# Altium project MCH_CLKB.PrjPcb (part 1 of 2)
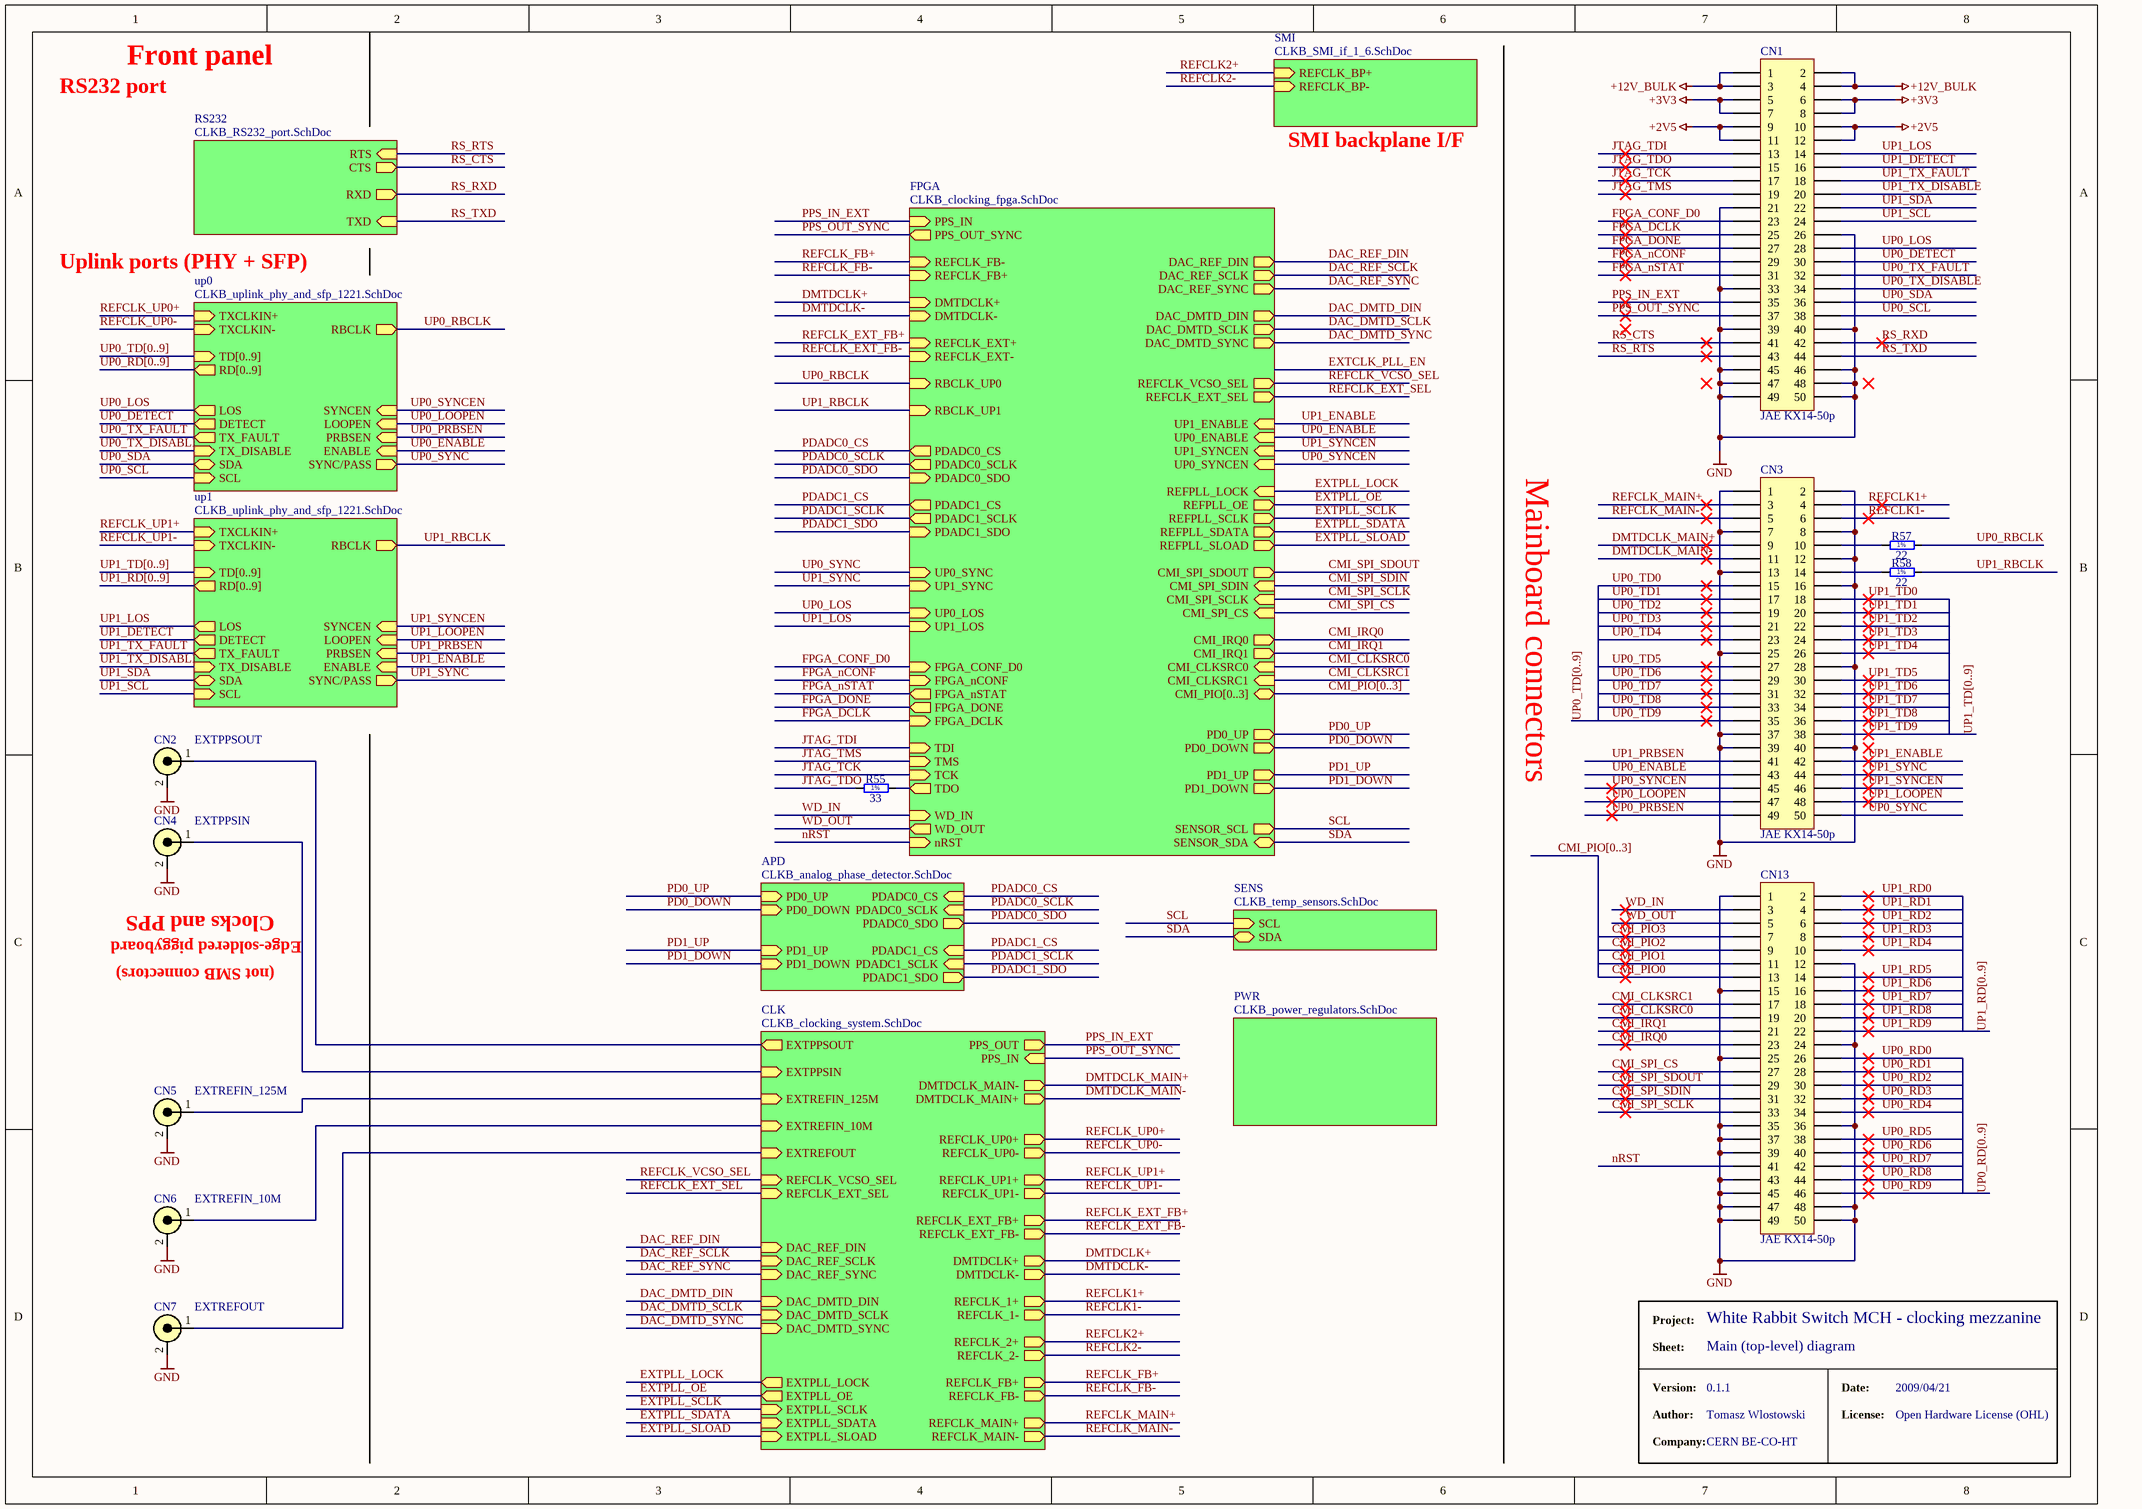
[diagram p0: CLKB_main.SchDoc]
7 sheets, 236 parts. Net scope: hierarchical (ports join the sheet entries above them; power ports are global).
Board file: MCH_CLKB_PCB.PcbDoc
Sheets:
  CLKB_main.SchDoc
    APD = CLKB_analog_phase_detector.SchDoc
    CLK = CLKB_clocking_system.SchDoc
    PWR = CLKB_power_regulators.SchDoc
    FPGA = CLKB_clocking_fpga.SchDoc
    RS232 = CLKB_RS232_port.SchDoc
    SENS = CLKB_temp_sensors.SchDoc

## Sheet CLKB_main.SchDoc
size A3

### Parts
CN1  JAE KX14-50p  [JAE_KX14_50P]
CN2  EXTPPSOUT  [MCH_SPECIAL_FP_CLOCKS]
CN3  JAE KX14-50p  [JAE_KX14_50P]
CN4  EXTPPSIN  [MCH_SPECIAL_FP_CLOCKS]
CN5  EXTREFIN_125M  [MCH_SPECIAL_FP_CLOCKS]
CN6  EXTREFIN_10M  [MCH_SPECIAL_FP_CLOCKS]
CN7  EXTREFOUT  [MCH_SPECIAL_FP_CLOCKS]
CN13  JAE KX14-50p  [JAE_KX14_50P]
R55  33  [RESC1608X55N]
R57  22  [RESC1608X55N]
R58  22  [RESC1608X55N]

### Sub-sheets
APD = CLKB_analog_phase_detector.SchDoc: PDADC1_SDO (out), PD0_UP (in), PDADC1_CS (in), PD1_DOWN (in), PD0_DOWN (in), PDADC0_CS (in), PDADC0_SDO (out), PDADC1_SCLK (in), PDADC0_SCLK (in), PD1_UP (in)
CLK = CLKB_clocking_system.SchDoc: EXTREFIN_10M (in), EXTREFIN_125M (in), REFCLK_EXT_SEL (in), EXTREFOUT (in), REFCLK_MAIN+ (out), REFCLK_MAIN- (out), REFCLK_FB+ (out), REFCLK_FB- (out), REFCLK_UP0+ (out), REFCLK_1- (out), REFCLK_2+ (out), REFCLK_2- (out), REFCLK_UP1- (out), REFCLK_1+ (out), DMTDCLK+ (out), DMTDCLK- (out), REFCLK_EXT_FB+ (out), REFCLK_EXT_FB- (out), DAC_DMTD_SYNC (in), DAC_DMTD_SCLK (in), DAC_DMTD_DIN (in), DAC_REF_SYNC (in), DAC_REF_SCLK (in), REFCLK_UP1+ (out), DAC_REF_DIN (in), REFCLK_UP0- (out), DMTDCLK_MAIN+ (out), DMTDCLK_MAIN- (out), REFCLK_VCSO_SEL (in), EXTPPSIN (in), PPS_IN (in), PPS_OUT (out), EXTPPSOUT (out), EXTPLL_LOCK (out), EXTPLL_OE (out), EXTPLL_SLOAD (in), EXTPLL_SDATA (in), EXTPLL_SCLK (in)
FPGA = CLKB_clocking_fpga.SchDoc: TDI (in), TDO (out), TCK (in), TMS (in), REFCLK_FB- (in), DMTDCLK+ (in), DMTDCLK- (in), REFCLK_EXT+ (in), REFCLK_EXT- (in), RBCLK_UP0 (in), RBCLK_UP1 (in), CMI_SPI_SDIN (in), CMI_SPI_SCLK (in), UP0_LOS (in), CMI_SPI_CS (in), CMI_SPI_SDOUT (out), UP1_LOS (in), FPGA_DCLK (in), DAC_REF_SYNC (out), DAC_REF_DIN (out), DAC_REF_SCLK (out), DAC_DMTD_SYNC (out), DAC_DMTD_SCLK (out), DAC_DMTD_DIN (out), CMI_IRQ0 (out), CMI_IRQ1 (out), CMI_CLKSRC0 (in), CMI_CLKSRC1 (in), CMI_PIO[0..3] (bidir), REFCLK_VCSO_SEL (out), REFCLK_EXT_SEL (out), UP0_SYNC (in), PDADC0_CS (out), PDADC0_SDO (in), PDADC0_SCLK (out), UP1_SYNC (in), FPGA_CONF_D0 (in), PDADC1_CS (out), PDADC1_SDO (in), PDADC1_SCLK (out), PD0_UP (out), PD0_DOWN (out), PD1_UP (out), PD1_DOWN (out), FPGA_DONE (out), FPGA_nCONF (in), FPGA_nSTAT (out), REFCLK_FB+ (in), UP1_ENABLE (in), UP0_ENABLE (in), UP1_SYNCEN (in), UP0_SYNCEN (in), WD_IN (in), WD_OUT (out), nRST (in), SENSOR_SCL (out), SENSOR_SDA (bidir), REFPLL_OE (out), REFPLL_SCLK (out), REFPLL_SDATA (out), REFPLL_SLOAD (out), REFPLL_LOCK (in), PPS_IN (in), PPS_OUT_SYNC (out)
PWR = CLKB_power_regulators.SchDoc: no entries
RS232 = CLKB_RS232_port.SchDoc: TXD (in), RXD (out), CTS (out), RTS (in)
SENS = CLKB_temp_sensors.SchDoc: SDA (bidir), SCL (in)
SMI = CLKB_SMI_if_1_6.SchDoc (file not in this document): REFCLK_BP+ (in), REFCLK_BP- (in)
up0 = CLKB_uplink_phy_and_sfp_1221.SchDoc (file not in this document): TD[0..9] (in), TXCLKIN+ (in), TXCLKIN- (in), TX_FAULT (out), TX_DISABLE (in), SDA (bidir), SCL (in), DETECT (out), LOS (out), SYNCEN (in), LOOPEN (in), PRBSEN (in), ENABLE (in), RBCLK (out), SYNC/PASS (out), RD[0..9] (out)
up1 = CLKB_uplink_phy_and_sfp_1221.SchDoc (file not in this document): TD[0..9] (in), TXCLKIN+ (in), TXCLKIN- (in), TX_FAULT (out), TX_DISABLE (in), SDA (bidir), SCL (in), DETECT (out), LOS (out), SYNCEN (in), LOOPEN (in), PRBSEN (in), ENABLE (in), RBCLK (out), SYNC/PASS (out), RD[0..9] (out)

### Nets
+2V5: CN1.9 CN1.10 CN1.11 CN1.12
+3V3: CN1.5 CN1.6 CN1.7 CN1.8
+12V_BULK: CN1.1 CN1.2 CN1.3 CN1.4
GND: CN1.21 CN1.26 CN1.33 CN1.39 CN1.40 CN1.45 CN1.46 CN1.47 CN1.48 CN1.49 CN1.50 CN2.2(GND) CN3.1 CN3.2 CN3.7 CN3.8 CN3.12 CN3.13 CN3.16 CN3.25 CN3.28 CN3.37 CN3.39 CN3.40 CN4.2(GND) CN5.2(GND) CN6.2(GND) CN7.2(GND) CN13.1 CN13.12 CN13.15 CN13.24 CN13.25 CN13.35 CN13.36 CN13.37 CN13.39 CN13.43 CN13.45 CN13.47 CN13.48 CN13.49 CN13.50
CMI_CLKSRC0: CN13.19 ; sheet FPGA/CMI_CLKSRC0
CMI_CLKSRC1: CN13.17 ; sheet FPGA/CMI_CLKSRC1
CMI_IRQ0: CN13.23 ; sheet FPGA/CMI_IRQ0
CMI_IRQ1: CN13.21 ; sheet FPGA/CMI_IRQ1
CMI_PIO0: CN13.13
CMI_PIO1: CN13.11
CMI_PIO2: CN13.9
CMI_PIO3: CN13.7
CMI_SPI_CS: CN13.27 ; sheet FPGA/CMI_SPI_CS
CMI_SPI_SCLK: CN13.33 ; sheet FPGA/CMI_SPI_SCLK
CMI_SPI_SDIN: CN13.31 ; sheet FPGA/CMI_SPI_SDIN
CMI_SPI_SDOUT: CN13.29 ; sheet FPGA/CMI_SPI_SDOUT
DAC_DMTD_DIN: sheet CLK/DAC_DMTD_DIN, sheet FPGA/DAC_DMTD_DIN
DAC_DMTD_SCLK: sheet CLK/DAC_DMTD_SCLK, sheet FPGA/DAC_DMTD_SCLK
DAC_DMTD_SYNC: sheet CLK/DAC_DMTD_SYNC, sheet FPGA/DAC_DMTD_SYNC
DAC_REF_DIN: sheet CLK/DAC_REF_DIN, sheet FPGA/DAC_REF_DIN
DAC_REF_SCLK: sheet CLK/DAC_REF_SCLK, sheet FPGA/DAC_REF_SCLK
DAC_REF_SYNC: sheet CLK/DAC_REF_SYNC, sheet FPGA/DAC_REF_SYNC
DMTDCLK+: sheet CLK/DMTDCLK+, sheet FPGA/DMTDCLK+
DMTDCLK-: sheet CLK/DMTDCLK-, sheet FPGA/DMTDCLK-
DMTDCLK_MAIN+: CN3.9 ; sheet CLK/DMTDCLK_MAIN-
DMTDCLK_MAIN-: CN3.11 ; sheet CLK/DMTDCLK_MAIN+
EXTPLL_LOCK: sheet CLK/EXTPLL_LOCK, sheet FPGA/REFPLL_LOCK
EXTPLL_OE: sheet CLK/EXTPLL_OE, sheet FPGA/REFPLL_OE
EXTPLL_SCLK: sheet CLK/EXTPLL_SCLK, sheet FPGA/REFPLL_SCLK
EXTPLL_SDATA: sheet CLK/EXTPLL_SDATA, sheet FPGA/REFPLL_SDATA
EXTPLL_SLOAD: sheet CLK/EXTPLL_SLOAD, sheet FPGA/REFPLL_SLOAD
EXTPPSIN: CN4.1(HOT) ; sheet CLK/EXTPPSIN
EXTPPSOUT: CN2.1(HOT) ; sheet CLK/EXTPPSOUT
EXTREFIN_10M: CN6.1(HOT) ; sheet CLK/EXTREFIN_10M
EXTREFIN_125M: CN5.1(HOT) ; sheet CLK/EXTREFIN_125M
EXTREFOUT: CN7.1(HOT) ; sheet CLK/EXTREFOUT
FPGA_CONF_D0: CN1.23 ; sheet FPGA/FPGA_CONF_D0
FPGA_DCLK: CN1.25 ; sheet FPGA/FPGA_DCLK
FPGA_DONE: CN1.27 ; sheet FPGA/FPGA_DONE
FPGA_nCONF: CN1.29 ; sheet FPGA/FPGA_nCONF
FPGA_nSTAT: CN1.31 ; sheet FPGA/FPGA_nSTAT
JTAG_TCK: CN1.17 ; sheet FPGA/TCK
JTAG_TDI: CN1.13 ; sheet FPGA/TDI
JTAG_TDO: CN1.15 R55.1
JTAG_TMS: CN1.19 ; sheet FPGA/TMS
nRST: CN13.41 ; sheet FPGA/nRST
PD0_DOWN: sheet APD/PD0_DOWN, sheet FPGA/PD0_DOWN
PD0_UP: sheet APD/PD0_UP, sheet FPGA/PD0_UP
PD1_DOWN: sheet APD/PD1_DOWN, sheet FPGA/PD1_DOWN
PD1_UP: sheet APD/PD1_UP, sheet FPGA/PD1_UP
PDADC0_CS: sheet APD/PDADC0_CS, sheet FPGA/PDADC0_CS
PDADC0_SCLK: sheet APD/PDADC0_SCLK, sheet FPGA/PDADC0_SCLK
PDADC0_SDO: sheet APD/PDADC0_SDO, sheet FPGA/PDADC0_SDO
PDADC1_CS: sheet APD/PDADC1_CS, sheet FPGA/PDADC1_CS
PDADC1_SCLK: sheet APD/PDADC1_SCLK, sheet FPGA/PDADC1_SCLK
PDADC1_SDO: sheet APD/PDADC1_SDO, sheet FPGA/PDADC1_SDO
PPS_IN_EXT: CN1.35 ; sheet CLK/PPS_OUT, sheet FPGA/PPS_IN
PPS_OUT_SYNC: CN1.37 ; sheet CLK/PPS_IN, sheet FPGA/PPS_OUT_SYNC
REFCLK1+: CN3.4 ; sheet CLK/REFCLK_1+
REFCLK1-: CN3.6 ; sheet CLK/REFCLK_1-
REFCLK2+: sheet CLK/REFCLK_2+, sheet SMI/REFCLK_BP+
REFCLK2-: sheet CLK/REFCLK_2-, sheet SMI/REFCLK_BP-
REFCLK_EXT_FB+: sheet CLK/REFCLK_EXT_FB+, sheet FPGA/REFCLK_EXT+
REFCLK_EXT_FB-: sheet CLK/REFCLK_EXT_FB-, sheet FPGA/REFCLK_EXT-
REFCLK_EXT_SEL: sheet CLK/REFCLK_EXT_SEL, sheet FPGA/REFCLK_EXT_SEL
REFCLK_FB+: sheet CLK/REFCLK_FB+, sheet FPGA/REFCLK_FB-
REFCLK_FB-: sheet CLK/REFCLK_FB-, sheet FPGA/REFCLK_FB+
REFCLK_MAIN+: CN3.3 ; sheet CLK/REFCLK_MAIN+
REFCLK_MAIN-: CN3.5 ; sheet CLK/REFCLK_MAIN-
REFCLK_UP0+: sheet CLK/REFCLK_UP0+, sheet up0/TXCLKIN+
REFCLK_UP0-: sheet CLK/REFCLK_UP0-, sheet up0/TXCLKIN-
REFCLK_UP1+: sheet CLK/REFCLK_UP1+, sheet up1/TXCLKIN+
REFCLK_UP1-: sheet CLK/REFCLK_UP1-, sheet up1/TXCLKIN-
REFCLK_VCSO_SEL: sheet CLK/REFCLK_VCSO_SEL, sheet FPGA/REFCLK_VCSO_SEL
RS_CTS: CN1.41 ; sheet RS232/CTS
RS_RTS: CN1.43 ; sheet RS232/RTS
RS_RXD: CN1.42 ; sheet RS232/RXD
RS_TXD: CN1.44 ; sheet RS232/TXD
SCL: sheet FPGA/SENSOR_SCL, sheet SENS/SCL
SDA: sheet FPGA/SENSOR_SDA, sheet SENS/SDA
TDO: R55.2 ; sheet FPGA/TDO
UP0_DETECT: CN1.30 ; sheet up0/DETECT
UP0_ENABLE: CN3.43 ; sheet FPGA/UP0_ENABLE, sheet up0/ENABLE
UP0_LOOPEN: CN3.47 ; sheet up0/LOOPEN
UP0_LOS: CN1.28 ; sheet FPGA/UP0_LOS, sheet up0/LOS
UP0_PRBSEN: CN3.49 ; sheet up0/PRBSEN
UP0_RBCLK: R57.2 ; sheet FPGA/RBCLK_UP0, sheet up0/RBCLK
UP0_RD0: CN13.26
UP0_RD1: CN13.28
UP0_RD2: CN13.30
UP0_RD3: CN13.32
UP0_RD4: CN13.34
UP0_RD5: CN13.38
UP0_RD6: CN13.40
UP0_RD7: CN13.42
UP0_RD8: CN13.44
UP0_RD9: CN13.46
UP0_SCL: CN1.38 ; sheet up0/SCL
UP0_SDA: CN1.36 ; sheet up0/SDA
UP0_SYNC: CN3.50 ; sheet FPGA/UP0_SYNC, sheet up0/SYNC/PASS
UP0_SYNCEN: CN3.45 ; sheet FPGA/UP0_SYNCEN, sheet up0/SYNCEN
UP0_TD0: CN3.15
UP0_TD1: CN3.17
UP0_TD2: CN3.19
UP0_TD3: CN3.21
UP0_TD4: CN3.23
UP0_TD5: CN3.27
UP0_TD6: CN3.29
UP0_TD7: CN3.31
UP0_TD8: CN3.33
UP0_TD9: CN3.35
UP0_TX_DISABLE: CN1.34 ; sheet up0/TX_DISABLE
UP0_TX_FAULT: CN1.32 ; sheet up0/TX_FAULT
UP1_DETECT: CN1.16 ; sheet up1/DETECT
UP1_ENABLE: CN3.42 ; sheet FPGA/UP1_ENABLE, sheet up1/ENABLE
UP1_LOOPEN: CN3.48 ; sheet up1/LOOPEN
UP1_LOS: CN1.14 ; sheet FPGA/UP1_LOS, sheet up1/LOS
UP1_PRBSEN: CN3.41 ; sheet up1/PRBSEN
UP1_RBCLK: R58.2 ; sheet FPGA/RBCLK_UP1, sheet up1/RBCLK
UP1_RD0: CN13.2
UP1_RD1: CN13.4
UP1_RD2: CN13.6
UP1_RD3: CN13.8
UP1_RD4: CN13.10
UP1_RD5: CN13.14
UP1_RD6: CN13.16
UP1_RD7: CN13.18
UP1_RD8: CN13.20
UP1_RD9: CN13.22
UP1_SCL: CN1.24 ; sheet up1/SCL
UP1_SDA: CN1.22 ; sheet up1/SDA
UP1_SYNC: CN3.44 ; sheet FPGA/UP1_SYNC, sheet up1/SYNC/PASS
UP1_SYNCEN: CN3.46 ; sheet FPGA/UP1_SYNCEN, sheet up1/SYNCEN
UP1_TD0: CN3.18
UP1_TD1: CN3.20
UP1_TD2: CN3.22
UP1_TD3: CN3.24
UP1_TD4: CN3.26
UP1_TD5: CN3.30
UP1_TD6: CN3.32
UP1_TD7: CN3.34
UP1_TD8: CN3.36
UP1_TD9: CN3.38
UP1_TX_DISABLE: CN1.20 ; sheet up1/TX_DISABLE
UP1_TX_FAULT: CN1.18 ; sheet up1/TX_FAULT
WD_IN: CN13.3 ; sheet FPGA/WD_IN
WD_OUT: CN13.5 ; sheet FPGA/WD_OUT
NetCN3_10: CN3.10 R57.1
NetCN3_14: CN3.14 R58.1

### Buses and harness runs
bus CMI_PIO[0..3]
bus CMI_PIO[0..3] = sheet FPGA/CMI_PIO[0..3]
bus UP0_RD[0..9]
bus UP0_RD[0..9] = sheet up0/RD[0..9]
bus UP0_TD[0..9]
bus UP0_TD[0..9] = sheet up0/TD[0..9]
bus UP1_RD[0..9]
bus UP1_RD[0..9] = sheet up1/RD[0..9]
bus UP1_TD[0..9]
bus UP1_TD[0..9] = sheet up1/TD[0..9]

### Notes on the sheet
- RS232 port
- Front panel
- SMI backplane I/F
- Uplink ports (PHY + SFP)
- Mainboard connectors
- Clocks and PPS
- (not SMB connectors)
- Edge-soldered piggyboard
- Project:
- White Rabbit Switch MCH - clocking mezzanine
- Sheet:
- Version:
- Main (top-level) diagram
- 0.1.1
- Date:
- 2009/04/21
- Author:
- Company:
- Tomasz Wlostowski
- CERN BE-CO-HT
- License:
- Open Hardware License (OHL)
- (in symbol R0603_22R_1%_0.1W_100PPM) 1%
- (in symbol R0603_33R_1%_0.1W_100PPM) 1%

### Library data of the parts
CN1 CN3 CN13 = KX14_50p: multipin B2B connector (plug); Supplier: Farnell
CN2 CN4-CN7 = SMA_SOCKET: SMB piggyboard connection
R55 = R0603_33R_1%_0.1W_100PPM: Resistor - 1%; Part Description: General Purpose Thick Film Chip Resistor; Manufacturer: GENERIC; Manufacturer1 Part Number: NRC06F33R0TRF; Manufacturer1 Datasheet: \\cern.ch\dfs\Applications\Altium\Datasheets\R0603_NIC_NRC.pdf; Power: 0.1W; TC: ±100ppm/°C; Table: Resistors SMD; Part Number: R0603_33R_1%_0.1W_100PPM; Component Kind: Standard; Component Type: Standard; Designator: Resistor - 1%; Library Reference: Resistor - 1%; Pin Count: 2; Value: 33; Status: Preferred; Tolerance: ±1%; Manufacturer Part Number: R0603_33R_1%_0.1W_100PPM; Case: 0603; Mounted: Yes; Socket: No; SMD: Yes; Manufacturer1 Example: NIC COMPONENT; Manufacturer1 ComponentHeight: 0.55mm; HelpURL: \\cern.ch\dfs\Applications\Altium\Datasheets\R0603_NIC_NRC.pdf; Author: CERN DEM JLC; CreateDate: 12/3/2007; LatestRevisionDate: 3/13/2008
R57 R58 = R0603_22R_1%_0.1W_100PPM: Resistor - 1%; Part Description: General Purpose Thick Film Chip Resistor; Manufacturer: GENERIC; Manufacturer1 Part Number: NRC06F22R0TRF; Manufacturer1 Datasheet: \\cern.ch\dfs\Applications\Altium\Datasheets\R0603_NIC_NRC.pdf; Power: 0.1W; TC: ±100ppm/°C; Table: Resistors SMD; Part Number: R0603_22R_1%_0.1W_100PPM; Component Kind: Standard; Component Type: Standard; Designator: Resistor - 1%; Library Reference: Resistor - 1%; Pin Count: 2; Value: 22; Status: Preferred; Tolerance: ±1%; Manufacturer Part Number: R0603_22R_1%_0.1W_100PPM; Case: 0603; Mounted: Yes; Socket: No; SMD: Yes; Manufacturer1 Example: NIC COMPONENT; Manufacturer1 ComponentHeight: 0.55mm; HelpURL: \\cern.ch\dfs\Applications\Altium\Datasheets\R0603_NIC_NRC.pdf; Author: CERN DEM JLC; CreateDate: 12/3/2007; LatestRevisionDate: 3/13/2008

## Sheet CLKB_analog_phase_detector.SchDoc
size A
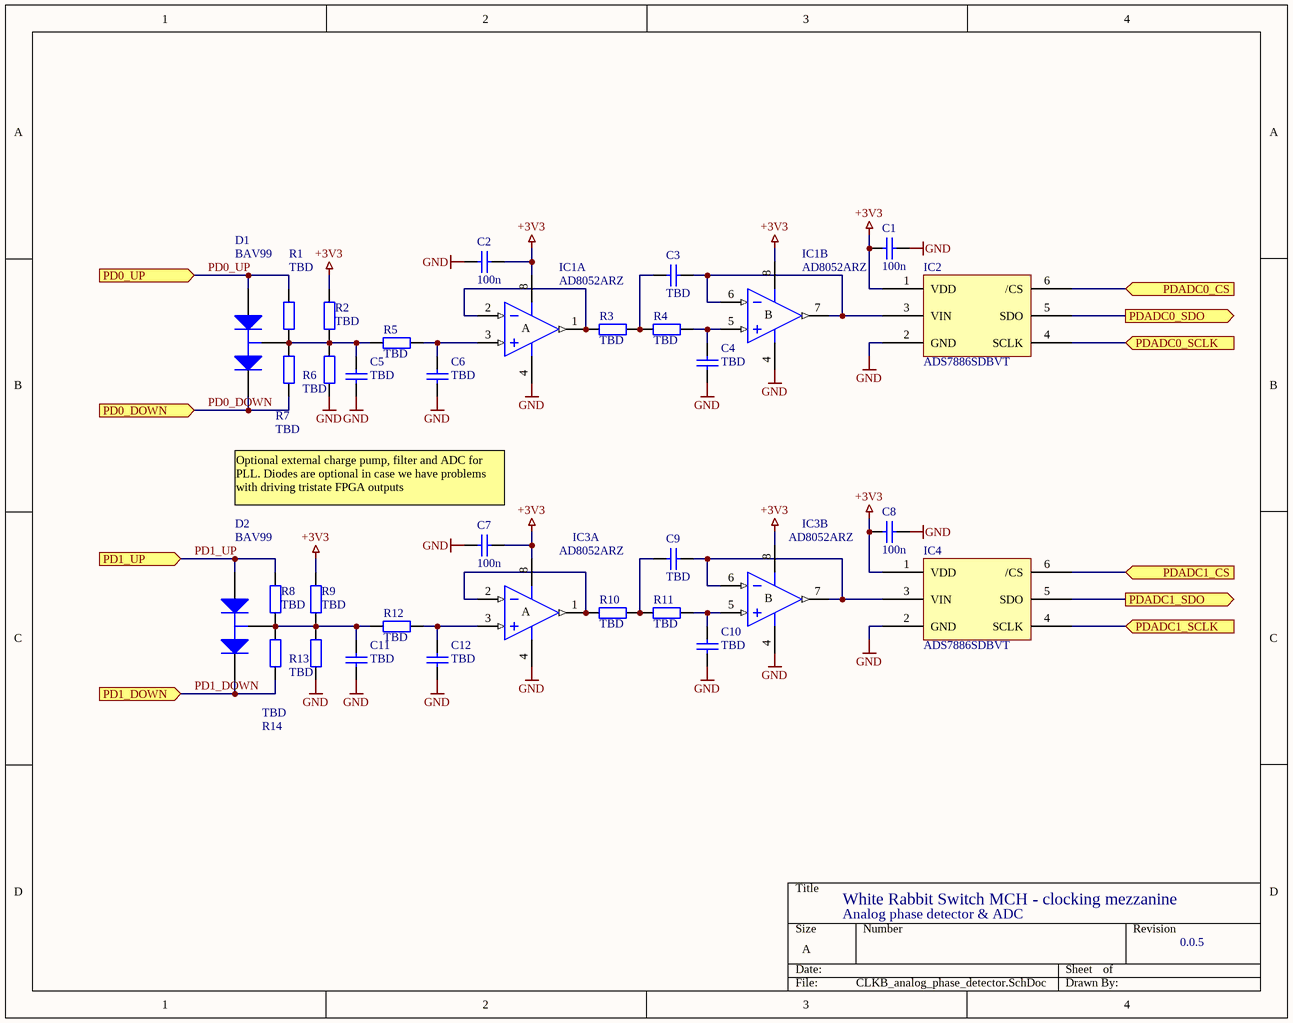
[diagram p1: CLKB_analog_phase_detector.SchDoc]

### Parts
C1  value 100n  [CAPC1608X87N]  (hidden comment: Cap)
C2  value 100n  [CAPC1608X87N]  (hidden comment: Cap)
C3  value TBD  [CAPC1608X87N]  (hidden comment: Cap)
C4  value TBD  [CAPC1608X87N]  (hidden comment: Cap)
C5  value TBD  [CAPC1608X87N]  (hidden comment: Cap)
C6  value TBD  [CAPC1608X87N]  (hidden comment: Cap)
C7  value 100n  [CAPC1608X87N]  (hidden comment: Cap)
C8  value 100n  [CC1608-0603]  (hidden comment: Cap)
C9  value TBD  [CAPC1608X87N]  (hidden comment: Cap)
C10  value TBD  [CAPC1608X87N]  (hidden comment: Cap)
C11  value TBD  [CAPC1608X87N]  (hidden comment: Cap)
C12  value TBD  [CAPC1608X87N]  (hidden comment: Cap)
D1  BAV99  [SOT-23]
D2  BAV99  [SOT-23]
IC1  value AD8052ARZ  [SOIC127P600-8AL]  (hidden comment: AD8052)  (parts A,B of 2)
IC2  value ADS7886SDBVT  [SOT23A-6L]  (hidden comment: ADS7886)
IC3  value AD8052ARZ  [SOIC127P600-8AL]  (hidden comment: AD8052)  (parts A,B of 2)
IC4  value ADS7886SDBVT  [SOT23A-6L]  (hidden comment: ADS7886)
R1  value TBD  [RESC1608X55N]  (hidden comment: Res2)
R2  value TBD  [RESC1608X55N]  (hidden comment: Res2)
R3  value TBD  [RESC1608X55N]  (hidden comment: Res2)
R4  value TBD  [RESC1608X55N]  (hidden comment: Res2)
R5  value TBD  [RESC1608X55N]  (hidden comment: Res2)
R6  value TBD  [RESC1608X55N]  (hidden comment: Res2)
R7  value TBD  [RESC1608X55N]  (hidden comment: Res2)
R8  value TBD  [RESC1608X55N]  (hidden comment: Res2)
R9  value TBD  [RESC1608X55N]  (hidden comment: Res2)
R10  value TBD  [RESC1608X55N]  (hidden comment: Res2)
R11  value TBD  [RESC1608X55N]  (hidden comment: Res2)
R12  value TBD  [RESC1608X55N]  (hidden comment: Res2)
R13  value TBD  [RESC1608X55N]  (hidden comment: Res2)
R14  value TBD  [RESC1608X55N]  (hidden comment: Res2)

### Ports
PD0_DOWN (in), PD0_UP (in), PD1_DOWN (in), PD1_UP (in), PDADC0_CS (in), PDADC0_SCLK (in), PDADC0_SDO (out), PDADC1_CS (in), PDADC1_SCLK (in), PDADC1_SDO (out)

### Nets
+3V3: C1.1 C2.1 C7.1 C8.1 IC1.8(V+) IC2.1(VDD) IC3.8(V+) IC4.1(VDD) R2.2 R9.2
GND: C1.2 C2.2 C4.1 C5.1 C6.1 C7.2 C8.2 C10.1 C11.1 C12.1 IC1.4(V-) IC2.2(GND) IC3.4(V-) IC4.2(GND) R6.1 R13.1
PD0_DOWN: D1.2(K) R7.1 ; port PD0_DOWN
PD0_UP: D1.1(A) R1.2 ; port PD0_UP
PD1_DOWN: D2.2(K) R14.1 ; port PD1_DOWN
PD1_UP: D2.1(A) R8.2 ; port PD1_UP
PDADC0_CS: IC2.6(/CS) ; port PDADC0_CS
PDADC0_SCLK: IC2.4(SCLK) ; port PDADC0_SCLK
PDADC0_SDO: IC2.5(SDO) ; port PDADC0_SDO
PDADC1_CS: IC4.6(/CS) ; port PDADC1_CS
PDADC1_SCLK: IC4.4(SCLK) ; port PDADC1_SCLK
PDADC1_SDO: IC4.5(SDO) ; port PDADC1_SDO
NetC3_1: C3.1 IC1.6(IN-) IC1.7(OUT) IC2.3(VIN)
NetC3_2: C3.2 R3.2 R4.1
NetC4_2: C4.2 IC1.5(IN+) R4.2
NetC5_2: C5.2 D1.3(C) R1.1 R2.1 R5.1 R6.2 R7.2
NetC6_2: C6.2 IC1.3(IN+) R5.2
NetC9_1: C9.1 IC3.6(IN-) IC3.7(OUT) IC4.3(VIN)
NetC9_2: C9.2 R10.2 R11.1
NetC10_2: C10.2 IC3.5(IN+) R11.2
NetC11_2: C11.2 D2.3(C) R8.1 R9.1 R12.1 R13.2 R14.2
NetC12_2: C12.2 IC3.3(IN+) R12.2
NetIC1_1: IC1.1(OUT) IC1.2(IN-) R3.1
NetIC3_1: IC3.1(OUT) IC3.2(IN-) R10.1

### Notes on the sheet
- (near C7) Optional external charge pump, filter and ADC for PLL. Diodes are optional in case we have problems with driving tristate FPGA outputs
- White Rabbit Switch MCH - clocking mezzanine
- Analog phase detector & ADC
- 0.0.5
- (in symbol AD8052, part A) A
- (in symbol AD8052, part B) B

### Library data of the parts
C1-C12 = Cap: Capacitor; Published: 8-Jun-2000; Revision: July-2002: Re-released for DXP Platform.; Publisher: Altium Limited
D1 D2 = BAV99: Silicon Switching Diode Array for High-Speed Switching; RefId: 1081211; Published: 21-Mar-2003; DatasheetDocument: Oct-1999; PackageDocument: Sep-2001; PackageReference: SOT-23; Publisher: Altium Limited; ComponentLink1Description: Manufacturer Link; ComponentLink1URL: http://www.infineon.com/; ComponentLink2Description: Datasheet; ComponentLink2URL: http://www.infineon.com/upload/Document/cmc_upload/documents/080/631/bav99series_1.pdf; Supplier: Farnell; Value: BAV99
IC1 IC3 = AD8052: Low Cost, High-Speed Rail-to-Rail Amplifier; Package Information: Latest Revision: 1997; RefId: 9425616; Published: 8-Jun-2000; Revision: 17-Jul-2002: Re-released for DXP Platform.; Datasheet: Latest Revision: REV. A 1999; Package Reference: RM-08; Publisher: Altium Limited; Supplier: Farnell
IC2 IC4 = ADS7886: TI 1 MSPS serial ADC; RefId: 1575257; Supplier: Farnell
R1-R14 = Res2: Resistor; Published: 8-Jun-2000; Revision: July-2002: Re-released for DXP Platform.; Publisher: Altium Limited

## Sheet CLKB_clocking_system.SchDoc
size A3
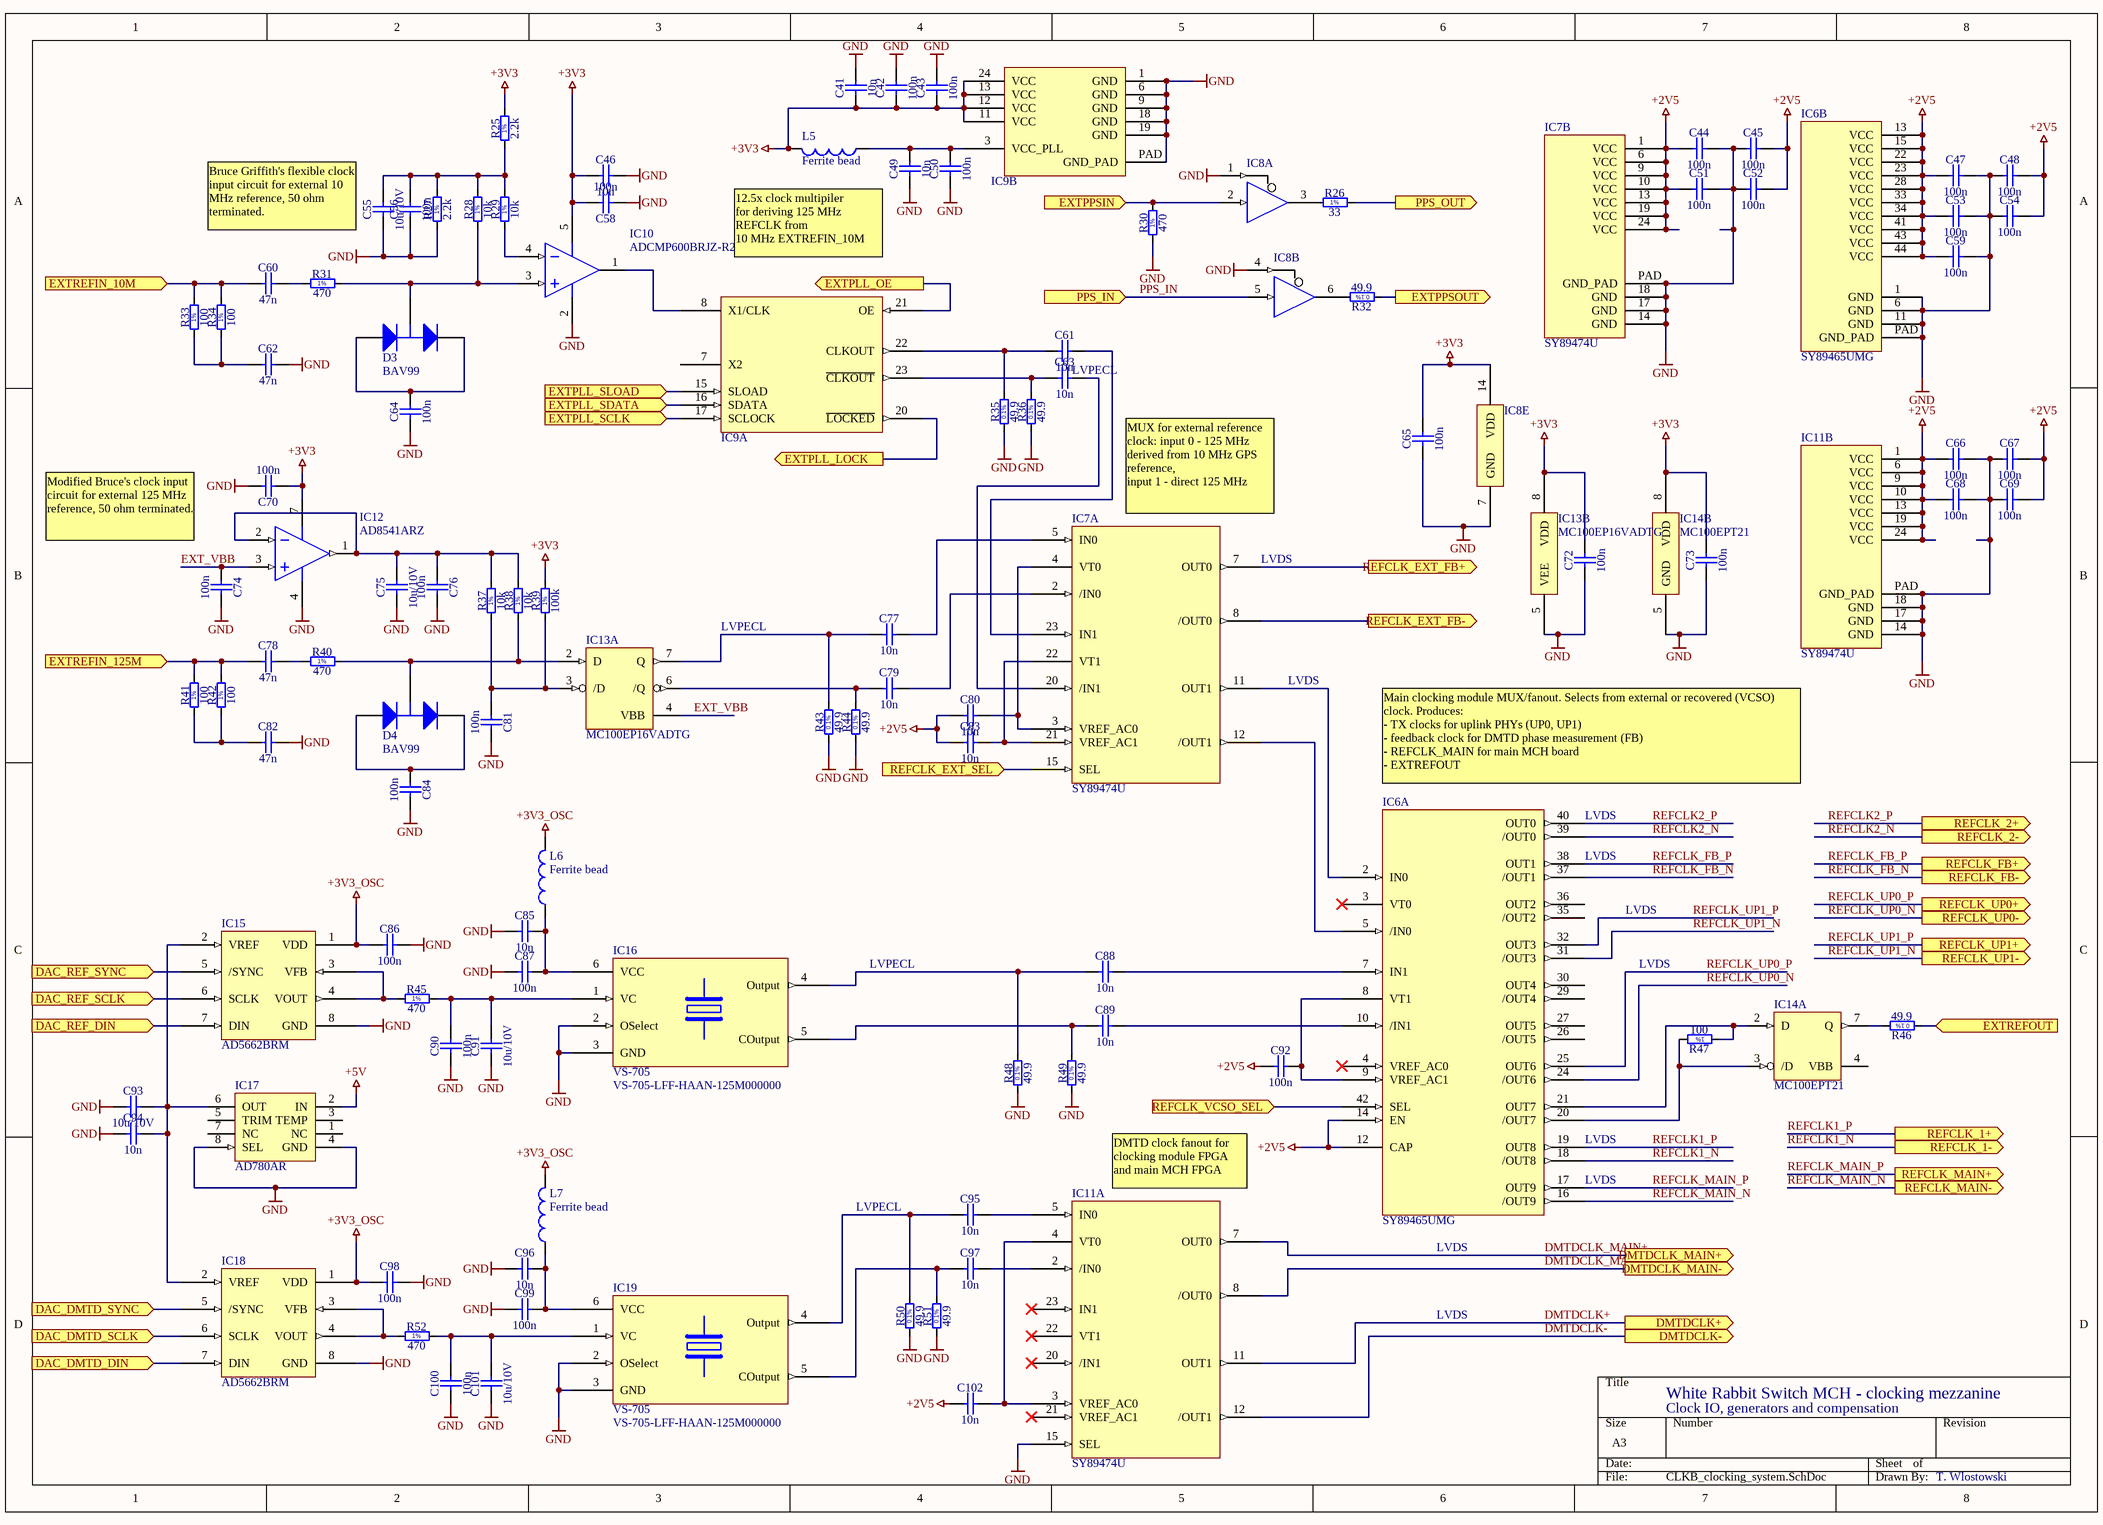
[diagram p2: CLKB_clocking_system.SchDoc]

### Parts
C41  10n  [CAPC1608X87N]
C42  100n  [CAPC1608X87N]
C43  100n  [CAPC1608X87N]
C44  100n  [CAPC1608X87N]
C45  100n  [CAPC1608X87N]
C46  10n  [CAPC1608X87N]
C47  100n  [CAPC1608X87N]
C48  100n  [CAPC1608X87N]
C49  10n  [CAPC1608X87N]
C50  100n  [CAPC1608X87N]
C51  100n  [CAPC1608X87N]
C52  100n  [CAPC1608X87N]
C53  100n  [CAPC1608X87N]
C54  100n  [CAPC1608X87N]
C55  10u/10V  [CAPC3216X140N]
C56  100n  [CAPC1608X87N]
C58  100n  [CAPC1608X87N]
C59  100n  [CAPC1608X87N]
C60  47n  [CAPC1608X87N]
C61  10n  [CAPC1608X87N]
C62  47n  [CAPC1608X87N]
C63  10n  [CAPC1608X87N]
C64  100n  [CAPC1608X87N]
C65  100n  [CAPC1608X87N]
C66  100n  [CAPC1608X87N]
C67  100n  [CAPC1608X87N]
C68  100n  [CAPC1608X87N]
C69  100n  [CAPC1608X87N]
C70  100n  [CAPC1608X87N]
C72  100n  [CAPC1608X87N]
C73  100n  [CAPC1608X87N]
C74  100n  [CAPC1608X87N]
C75  10u/10V  [CAPC3216X140N]
C76  100n  [CAPC1608X87N]
C77  10n  [CAPC1608X87N]
C78  47n  [CAPC1608X87N]
C79  10n  [CAPC1608X87N]
C80  10n  [CAPC1608X87N]
C81  100n  [CAPC1608X87N]
C82  47n  [CAPC1608X87N]
C83  10n  [CAPC1608X87N]
C84  100n  [CAPC1608X87N]
C85  10n  [CAPC1608X87N]
C86  100n  [CAPC1608X87N]
C87  100n  [CAPC1608X87N]
C88  10n  [CAPC1608X87N]
C89  10n  [CAPC1608X87N]
C90  100n  [CAPC1608X87N]
C91  10u/10V  [CAPC3216X140N]
C92  100n  [CAPC1608X87N]
C93  10u/10V  [CAPC3216X140N]
C94  10n  [CAPC1608X87N]
C95  10n  [CAPC1608X87N]
C96  10n  [CAPC1608X87N]
C97  10n  [CAPC1608X87N]
C98  100n  [CAPC1608X87N]
C99  100n  [CAPC1608X87N]
C100  100n  [CAPC1608X87N]
C101  10u/10V  [CAPC3216X140N]
C102  10n  [CAPC1608X87N]
D3  BAV99  [SOT-23]
D4  BAV99  [SOT-23]
IC6  value SY89465UMG  [MLF44]  (hidden comment: SY89465U)  (parts A,B of 2)
IC7  SY89474U  [MLF24]  (parts A,B of 2)
IC8  SN74ALVC125  [SO-14]  (value not drawn)  (parts A,B,E of 5)
IC9  NB4n441  [QFN50P400X400-24W4M]  (value not drawn)  (parts A,B of 2)
IC10  value ADCMP600BRJZ-R2  [SOT23-5AL]  (hidden comment: ADCMP600)
IC11  SY89474U  [MLF24]  (parts A,B of 2)
IC12  value AD8541ARZ  [SOIC127P600-8AL]  (hidden comment: AD8541)
IC13  value MC100EP16VADTG  [TSOP65P490-8AN]  (hidden comment: MC100EP16)  (parts A,B of 2)
IC14  MC100EPT21  [TSOP65P490-8AN]  (parts A,B of 2)
IC15  value AD5662BRM  [TSOP65P490-8AN]  (hidden comment: AD5662B)
IC16  VS-705  value VS-705-LFF-HAAN-125M000000  [VS-705]
IC17  AD780AR  [R-8C_M]
IC18  value AD5662BRM  [TSOP65P490-8AN]  (hidden comment: AD5662B)
IC19  VS-705  value VS-705-LFF-HAAN-125M000000  [VS-705]
L5  Ferrite bead  [INDC2012-0805]
L6  Ferrite bead  [INDC2012-0805]
L7  Ferrite bead  [INDC2012-0805]
R25  2.2k  [RESC1608X55N]
R26  33  [RESC1608X55N]
R27  2.2k  [RESC1608X55N]
R28  10k  [RESC1608X55N]
R29  10k  [RESC1608X55N]
R30  470  [RESC1608X55N]
R31  470  [RESC1608X55N]
R32  49.9  [RESC1608X55N]
R33  100  [RESC1608X55N]
R34  100  [RESC1608X55N]
R35  49.9  [RESC1608X55N]
R36  49.9  [RESC1608X55N]
R37  10k  [RESC1608X55N]
R38  10k  [RESC1608X55N]
R39  100k  [RESC1608X55N]
R40  470  [RESC1608X55N]
R41  100  [RESC1608X55N]
R42  100  [RESC1608X55N]
R43  49.9  [RESC1608X55N]
R44  49.9  [RESC1608X55N]
R45  470  [RESC1608X55N]
R46  49.9  [RESC1608X55N]
R47  100  [RESC1608X55N]
R48  49.9  [RESC1608X55N]
R49  49.9  [RESC1608X55N]
R50  49.9  [RESC1608X55N]
R51  49.9  [RESC1608X55N]
R52  470  [RESC1608X55N]

### Ports
DAC_DMTD_DIN (in), DAC_DMTD_SCLK (in), DAC_DMTD_SYNC (in), DAC_REF_DIN (in), DAC_REF_SCLK (in), DAC_REF_SYNC (in), DMTDCLK+ (out), DMTDCLK- (out), DMTDCLK_MAIN+ (out), DMTDCLK_MAIN- (out), EXTPLL_LOCK (out), EXTPLL_OE (out), EXTPLL_SCLK (in), EXTPLL_SDATA (in), EXTPLL_SLOAD (in), EXTPPSIN (in), EXTPPSOUT (out), EXTREFIN_10M (in), EXTREFIN_125M (in), EXTREFOUT (in), PPS_IN (in), PPS_OUT (out), REFCLK_1+ (out), REFCLK_1- (out), REFCLK_2+ (out), REFCLK_2- (out), REFCLK_EXT_FB+ (out), REFCLK_EXT_FB- (out), REFCLK_EXT_SEL (in), REFCLK_FB+ (out), REFCLK_FB- (out), REFCLK_MAIN+ (out), REFCLK_MAIN- (out), REFCLK_UP0+ (out), REFCLK_UP0- (out), REFCLK_UP1+ (out), REFCLK_UP1- (out), REFCLK_VCSO_SEL (in)

### Nets
+2V5: C44.1 C45.2 C47.1 C48.2 C51.1 C52.2 C53.1 C54.2 C59.1 C66.1 C67.2 C68.1 C69.2 C80.1 C83.1 C92.1 C102.1 IC6.12(CAP) IC6.13(VCC) IC6.14(EN) IC6.15(VCC) IC6.22(VCC) IC6.23(VCC) IC6.28(VCC) IC6.33(VCC) IC6.34(VCC) IC6.41(VCC) IC6.43(VCC) IC6.44(VCC) IC7.1(VCC) IC7.6(VCC) IC7.9(VCC) IC7.10(VCC) IC7.13(VCC) IC7.19(VCC) IC7.24(VCC) IC11.1(VCC) IC11.6(VCC) IC11.9(VCC) IC11.10(VCC) IC11.13(VCC) IC11.19(VCC) IC11.24(VCC)
+3V3: C41.1 C42.1 C43.1 C46.1 C58.2 C65.2 C70.1 C72.2 C73.2 IC8.14(VDD) IC9.11(VCC) IC9.12(VCC) IC9.13(VCC) IC9.24(VCC) IC10.5(VCC/VCCO) IC12.7(V+) IC13.8(VDD) IC14.8(VDD) L5.2 R25.2 R39.2
+3V3_OSC: C86.1 C98.1 IC15.1(VDD) IC18.1(VDD) L6.2 L7.2
+5V: IC17.2(IN)
GND: C41.2 C42.2 C43.2 C44.2 C45.1 C46.2 C47.2 C48.1 C49.1 C50.1 C51.2 C52.1 C53.2 C54.1 C55.1 C56.1 C58.1 C59.2 C62.2 C64.1 C65.1 C66.2 C67.1 C68.2 C69.1 C70.2 C72.1 C73.1 C74.2 C75.1 C76.2 C81.2 C82.2 C84.2 C85.1 C86.2 C87.1 C90.1 C91.1 C93.1 C94.1 C96.1 C98.2 C99.1 C100.1 C101.1 IC6.1(GND) IC6.6(GND) IC6.11(GND) IC6.PAD(GND_PAD) IC7.14(GND) IC7.17(GND) IC7.18(GND) IC7.PAD(GND_PAD) IC8.1(~{A}) IC8.4(~{A}) IC8.7(GND) IC9.1(GND) IC9.6(GND) IC9.9(GND) IC9.18(GND) IC9.19(GND) IC9.PAD(GND_PAD) IC10.2(VEE) IC11.14(GND) IC11.15(SEL) IC11.17(GND) IC11.18(GND) IC11.PAD(GND_PAD) IC12.4(V-) IC13.5(VEE) IC14.5(GND) IC15.8(GND) IC16.2(OSelect) IC16.3(GND) IC17.4(GND) IC17.8(SEL) IC18.8(GND) IC19.2(OSelect) IC19.3(GND) R27.1 R30.1 R35.1 R36.1 R43.1 R44.1 R48.1 R49.1 R50.1 R51.1
DAC_DMTD_DIN: IC18.7(DIN) ; port DAC_DMTD_DIN
DAC_DMTD_SCLK: IC18.6(SCLK) ; port DAC_DMTD_SCLK
DAC_DMTD_SYNC: IC18.5(/SYNC) ; port DAC_DMTD_SYNC
DAC_REF_DIN: IC15.7(DIN) ; port DAC_REF_DIN
DAC_REF_SCLK: IC15.6(SCLK) ; port DAC_REF_SCLK
DAC_REF_SYNC: IC15.5(/SYNC) ; port DAC_REF_SYNC
DMTDCLK+: IC11.11(OUT1) ; port DMTDCLK+
DMTDCLK-: IC11.12(/OUT1) ; port DMTDCLK-
DMTDCLK_MAIN+: IC11.7(OUT0) ; port DMTDCLK_MAIN+  [project net DMTDCLK_MAIN-]
DMTDCLK_MAIN-: IC11.8(/OUT0) ; port DMTDCLK_MAIN-  [project net DMTDCLK_MAIN+]
EXT_VBB: C74.1 IC12.3(IN+) IC13.4(VBB)
EXTPLL_LOCK: IC9.20(~{LOCKED}) ; port EXTPLL_LOCK
EXTPLL_OE: IC9.21(OE) ; port EXTPLL_OE
EXTPLL_SCLK: IC9.17(SCLOCK) ; port EXTPLL_SCLK
EXTPLL_SDATA: IC9.16(SDATA) ; port EXTPLL_SDATA
EXTPLL_SLOAD: IC9.15(SLOAD) ; port EXTPLL_SLOAD
EXTPPSIN: IC8.2(B) R30.2 ; port EXTPPSIN
EXTPPSOUT: R32.1 ; port EXTPPSOUT
EXTREFIN_10M: C60.1 R33.2 R34.2 ; port EXTREFIN_10M
EXTREFIN_125M: C78.1 R41.2 R42.2 ; port EXTREFIN_125M
EXTREFOUT: R46.1 ; port EXTREFOUT
PPS_IN: IC8.5(B) ; port PPS_IN  [project net PPS_OUT_SYNC]
PPS_IN_EXT: R26.2 ; port PPS_OUT
REFCLK1_N: IC6.18(/OUT8) ; port REFCLK_1-  [project net REFCLK1-]
REFCLK1_P: IC6.19(OUT8) ; port REFCLK_1+  [project net REFCLK1+]
REFCLK2_N: IC6.39(/OUT0) ; port REFCLK_2-  [project net REFCLK2-]
REFCLK2_P: IC6.40(OUT0) ; port REFCLK_2+  [project net REFCLK2+]
REFCLK_EXT_FB+: IC7.7(OUT0) ; port REFCLK_EXT_FB+
REFCLK_EXT_FB-: IC7.8(/OUT0) ; port REFCLK_EXT_FB-
REFCLK_EXT_SEL: IC7.15(SEL) ; port REFCLK_EXT_SEL
REFCLK_FB_N: IC6.37(/OUT1) ; port REFCLK_FB-  [project net REFCLK_FB-]
REFCLK_FB_P: IC6.38(OUT1) ; port REFCLK_FB+  [project net REFCLK_FB+]
REFCLK_MAIN_N: IC6.16(/OUT9) ; port REFCLK_MAIN-  [project net REFCLK_MAIN-]
REFCLK_MAIN_P: IC6.17(OUT9) ; port REFCLK_MAIN+  [project net REFCLK_MAIN+]
REFCLK_UP0_N: IC6.24(/OUT6) ; port REFCLK_UP0-  [project net REFCLK_UP0-]
REFCLK_UP0_P: IC6.25(OUT6) ; port REFCLK_UP0+  [project net REFCLK_UP0+]
REFCLK_UP1_N: IC6.31(/OUT3) ; port REFCLK_UP1-  [project net REFCLK_UP1-]
REFCLK_UP1_P: IC6.32(OUT3) ; port REFCLK_UP1+  [project net REFCLK_UP1+]
REFCLK_VCSO_SEL: IC6.42(SEL) ; port REFCLK_VCSO_SEL
NetC49_2: C49.2 C50.2 IC9.3(VCC_PLL) L5.1
NetC55_2: C55.2 C56.2 R25.1 R27.2 R28.2 R29.2
NetC60_2: C60.2 R31.1
NetC61_1: C61.1 IC9.22(CLKOUT) R35.2
NetC61_2: C61.2 IC7.23(IN1)
NetC62_1: C62.1 R33.1 R34.1
NetC63_1: C63.1 IC9.23(~{CLKOUT}) R36.2
NetC63_2: C63.2 IC7.20(/IN1)
NetC64_2: C64.2 D3.1(A) D3.2(K)
NetC75_2: C75.2 C76.1 IC12.1(OUT) IC12.2(IN-) R37.2 R38.2
NetC77_1: C77.1 IC13.7(Q) R43.2
NetC77_2: C77.2 IC7.5(IN0)
NetC78_2: C78.2 R40.1
NetC79_1: C79.1 IC13.6(/Q) R44.2
NetC79_2: C79.2 IC7.2(/IN0)
NetC80_2: C80.2 IC7.3(VREF_AC0) IC7.4(VT0)
NetC81_1: C81.1 IC13.3(/D) R37.1 R39.1
NetC82_1: C82.1 R41.1 R42.1
NetC83_2: C83.2 IC7.21(VREF_AC1) IC7.22(VT1)
NetC84_1: C84.1 D4.1(A) D4.2(K)
NetC85_2: C85.2 C87.2 IC16.6(VCC) L6.1
NetC88_1: C88.1 IC16.4(Output) R48.2
NetC88_2: C88.2 IC6.7(IN1)
NetC89_1: C89.1 IC16.5(COutput) R49.2
NetC89_2: C89.2 IC6.10(/IN1)
NetC90_2: C90.2 C91.2 IC16.1(VC) R45.2
NetC92_2: C92.2 IC6.8(VT1) IC6.9(VREF_AC1)
NetC93_2: C93.2 C94.2 IC15.2(VREF) IC17.6(OUT) IC18.2(VREF)
NetC95_1: C95.1 IC19.4(Output) R50.2
NetC95_2: C95.2 IC11.5(IN0)
NetC96_2: C96.2 C99.2 IC19.6(VCC) L7.1
NetC97_1: C97.1 IC19.5(COutput) R51.2
NetC97_2: C97.2 IC11.2(/IN0)
NetC100_2: C100.2 C101.2 IC19.1(VC) R52.2
NetC102_2: C102.2 IC11.3(VREF_AC0) IC11.4(VT0)
NetD3_3: D3.3(C) IC10.3(VP) R28.1 R31.2
NetD4_3: D4.3(C) IC13.2(D) R38.1 R40.2
NetIC6_2: IC6.2(IN0) IC7.11(OUT1)
NetIC6_5: IC6.5(/IN0) IC7.12(/OUT1)
NetIC6_20: IC6.20(/OUT7) IC14.3(/D) R47.2
NetIC6_21: IC6.21(OUT7) IC14.2(D) R47.1
NetIC8_3: IC8.3(Y) R26.1
NetIC8_6: IC8.6(Y) R32.2
NetIC9_8: IC9.8(X1/CLK) IC10.1(Q)
NetIC10_4: IC10.4(VN) R29.1
NetIC14_7: IC14.7(Q) R46.2
NetIC15_3: IC15.3(VFB) IC15.4(VOUT) R45.1
NetIC18_3: IC18.3(VFB) IC18.4(VOUT) R52.1

Not connected (* = marked no-connect by the designer): IC6 3(VT0)* 4(VREF_AC0)* 26(/OUT5) 27(OUT5) 29(/OUT4) 30(OUT4) 35(/OUT2) 36(OUT2); IC9 7(X2); IC11 20(/IN1)* 21(VREF_AC1)* 22(VT1)* 23(IN1)*; IC14 4(VBB); IC17 1(NC) 3(TEMP) 5(TRIM) 7(NC)

### Notes on the sheet
- (near C55) Bruce Griffith's flexible clock input circuit for external 10 MHz reference, 50 ohm terminated.
- 12.5x clock multipiler
  for deriving 125 MHz REFCLK from
  10 MHz EXTREFIN_10M
- (near C63) LVPECL
- (near IC7) MUX for external reference clock: input 0 - 125 MHz derived from 10 MHz GPS reference,
  input 1 - direct 125 MHz
- Modified Bruce's clock input circuit for external 125 MHz reference, 50 ohm terminated.
- (near IC7) LVDS
- LVPECL
- LVDS
- (near IC6) Main clocking module MUX/fanout. Selects from external or recovered (VCSO) clock. Produces:
  - TX clocks for uplink PHYs (UP0, UP1)
  - feedback clock for DMTD phase measurement (FB)
  - REFCLK_MAIN for main MCH board
  - EXTREFOUT
- (near IC6) LVDS
- (near IC11) DMTD clock fanout for clocking module FPGA and main MCH FPGA
- White Rabbit Switch MCH - clocking mezzanine
- Clock IO, generators and compensation
- T. Wlostowski
- (in symbol R0603_2K2_1%_0.1W_100PPM) 1%
- (in symbol R0603_10K_1%_0.1W_100PPM) 1%
- (in symbol R0603_33R_1%_0.1W_100PPM) 1%
- (in symbol R0603_49R9_0.1%_0.063W_10PPM) 0.1%
- (in symbol R0603_100K_1%_0.1W_100PPM) 1%
- (in symbol R0603_100R_1%_0.1W_100PPM) 1%
- (in symbol R0603_470R_1%_0.1W_100PPM) 1%

### Library data of the parts
C41 C46 C49 C61 C63 C77 C79 C80 C83 C85 C88 C89 C94-C97 C102 = CC0603_10NF_50V_10%_X7R: Non-polarised capacitor; Part Description: SMD Multilayer Chip Ceramic Capacitor; Manufacturer: GENERIC; Manufacturer1 Part Number: 223858615636; Manufacturer1 Datasheet: \\cern.ch\dfs\Applications\Altium\Datasheets\CC0603_X7R_PHYCOMP.pdf; Value: 10nF; Voltage: 50V; TC: X7R; Tolerance: ±10%; Table: Capacitors SMD; Part Number: CC0603_10NF_50V_10%_X7R; Component Kind: Standard; Component Type: Standard; Designator: Capacitor - non polarized; Library Reference: Capacitor - non polarized; Pin Count: 2; Status: Preferred; Manufacturer Part Number: CC0603_10NF_50V_10%_X7R; Case: 0603; Mounted: Yes; Socket: No; SMD: Yes; Manufacturer1 Example: PHYCOMP; Manufacturer1 ComponentHeight: 0.87mm; HelpURL: \\cern.ch\dfs\Applications\Altium\Datasheets\CC0603_X7R_PHYCOMP.pdf; Author: CERN DEM JLC; CreateDate: 12/3/2007; LatestRevisionDate: 12/3/2007
C42-C45 C47 C48 C50-C54 C56 C58 C59 C64-C70 C72-C74 C76 C81 C84 C86 C87 C90 C92 C98-C100 = CC0603_100NF_50V_10%_X7R: Non-polarised capacitor; Part Description: SMD Multilayer Chip Ceramic Capacitor; Manufacturer: GENERIC; Manufacturer1 Part Number: 223858615649; Manufacturer1 Datasheet: \\cern.ch\dfs\Applications\Altium\Datasheets\CC0603_X7R_PHYCOMP.pdf; Value: 100nF; Voltage: 50V; TC: X7R; Tolerance: ±10%; Table: Capacitors SMD; Part Number: CC0603_100NF_50V_10%_X7R; Component Kind: Standard; Component Type: Standard; Designator: Capacitor - non polarized; Library Reference: Capacitor - non polarized; Pin Count: 2; Status: Preferred; Manufacturer Part Number: CC0603_100NF_50V_10%_X7R; Case: 0603; Mounted: Yes; Socket: No; SMD: Yes; Manufacturer1 Example: PHYCOMP; Manufacturer1 ComponentHeight: 0.87mm; HelpURL: \\cern.ch\dfs\Applications\Altium\Datasheets\CC0603_X7R_PHYCOMP.pdf; Author: CERN DEM JLC; CreateDate: 12/3/2007; LatestRevisionDate: 12/3/2007
C55 C75 C91 C93 C101 = CC1206_10UF_10V_10%_X7R: Non-polarised capacitor; Part Description: SMD Multilayer Chip Ceramic Capacitor; Manufacturer: GENERIC; Manufacturer1 Part Number: C1206C106K8RAC; Manufacturer1 Datasheet: \\cern.ch\dfs\Applications\Altium\Datasheets\CC1206_X7R_KEMET.pdf; Value: 10uF; Voltage: 10V; TC: X7R; Tolerance: ±10%; Table: Capacitors SMD; Part Number: CC1206_10UF_10V_10%_X7R; Component Kind: Standard; Component Type: Standard; Designator: Capacitor - non polarized; Library Reference: Capacitor - non polarized; Pin Count: 2; Status: Preferred; Manufacturer Part Number: CC1206_10uF_10V_10%_X7R; Case: 1206; Mounted: Yes; Socket: No; SMD: Yes; Manufacturer1 Example: KEMET; Manufacturer1 ComponentHeight: 1.8mm; HelpURL: \\cern.ch\dfs\Applications\Altium\Datasheets\CC1206_X7R_KEMET.pdf; Author: CERN DEM JLC; CreateDate: 12/3/2007; LatestRevisionDate: 12/3/2007
C60 C62 C78 C82 = CC0603_47NF_25V_10%_X7R: Non-polarised capacitor; Part Description: SMD Multilayer Chip Ceramic Capacitor; Manufacturer: GENERIC; Manufacturer1 Part Number: 223891615645; Manufacturer1 Datasheet: \\cern.ch\dfs\Applications\Altium\Datasheets\CC0603_X7R_PHYCOMP.pdf; Value: 47nF; Voltage: 25V; TC: X7R; Tolerance: ±10%; Table: Capacitors SMD; Part Number: CC0603_47NF_25V_10%_X7R; Component Kind: Standard; Component Type: Standard; Designator: Capacitor - non polarized; Library Reference: Capacitor - non polarized; Pin Count: 2; Status: Preferred; Manufacturer Part Number: CC0603_47NF_25V_10%_X7R; Case: 0603; Mounted: Yes; Socket: No; SMD: Yes; Manufacturer1 Example: PHYCOMP; Manufacturer1 ComponentHeight: 0.87mm; HelpURL: \\cern.ch\dfs\Applications\Altium\Datasheets\CC0603_X7R_PHYCOMP.pdf; Author: CERN DEM JLC; CreateDate: 12/3/2007; LatestRevisionDate: 12/3/2007
D3 D4 = BAV99: as D1 on sheet CLKB_analog_phase_detector; Published: 21-Mar-2003; DatasheetDocument: Oct-1999; PackageDocument: Sep-2001; PackageReference: SOT-23; Publisher: Altium Limited; ComponentLink1Description: Manufacturer Link; ComponentLink1URL: http://www.infineon.com/; ComponentLink2Description: Datasheet; ComponentLink2URL: http://www.infineon.com/upload/Document/cmc_upload/documents/080/631/bav99series_1.pdf; Supplier: Farnell; Value: BAV99
IC6 = SY89465U: Micrel 2:10 any->LVDS clock fanout; RefId: 576-1476-1-ND; Supplier: Digikey
IC7 IC11 = SY89474U: 2:1 differential clock mux/2-output fanout; RefId: 576-2562-ND; Supplier: Digikey; Value: SY89474U
IC8 = SN74ALVC125: Quad Buffer with 3-State Outputs with TTL Compatible Inputs; Value: SN74ALVC125
IC9 = NB4n441: OnSemi single-chip clock synthesizer; Value: NB3N3020DTR2G; RefId: NB3N3020DTR2G-ND; Supplier: Digikey
IC10 = ADCMP600: Analog Devices fast comparator; RefId: 1441023; Supplier: Farnell
IC12 = AD8541: Analog Devices general purpose low-voltage R2R CMOS opamp; RefId: 9603859; Supplier: Farnell
IC13 = MC100EP16: ONSemi differental receiver w/ECL output; RefId: 1607606; Supplier: Farnell
IC14 = MC100EPT21: ONSemi LVDS/LVPECL -> LVTTL/LVCMOS buffer; RefId: MC100EPT21DTGOS-ND; Supplier: Digikey; Value: MC100EPT21
IC15 IC18 = AD5662: Analog Devices 16-bit DAC w/SPI interface, ext ref; RefId: 1117908; Supplier: Farnell
IC16 IC19 = VS-705: Vectron Voltage Controlled SAW Oscillator; Supplier: Vectron (?)
  IC16: RefID: VS-705-LFF-HAAN-125M000000
IC17 = AD780AR: 2.5V/3.0V High-Precision Reference; Note: Pins 1 and 7 are not connected; Value: AD780ARZ; RefId: AD780ARZ-ND; Published: 8-Jun-2000; LatestRevisionDate: 13-Apr-2006; LatestRevisionNote: IPC-7351 Footprint Added.; DatasheetVersion: REV. A; PackageVersion: revC; PackageReference: R-8C; Publisher: Altium Limited; PackageDescription: 8-Pin Small Outline Integrated Circuit 1.27 mm Pitch; Code_IPC: SOIC127P600-8; ComponentLink1Description: Manufacturer Link; ComponentLink1URL: http://www.analog.com/en/prod/0,,769_838_AD780%2C00.html; ComponentLink2Description: Datasheet; ComponentLink2URL: http://www.analog.com/UploadedFiles/Data_Sheets/87683462AD780_e.pdf; Supplier: Digikey
L5-L7 = Inductor: Code_IEC: 1005; Published: 8-Jun-2000; LatestRevisionDate: 17-Jul-2002; LatestRevisionNote: Re-released for DXP Platform.; PackageReference: 0402-A; Publisher: Altium Limited; Code_JEITA: 0402
R25 R27 = R0603_2K2_1%_0.1W_100PPM: Resistor - 1%; Part Description: General Purpose Thick Film Chip Resistor; Manufacturer: GENERIC; Manufacturer1 Part Number: NRC06F2201TRF; Manufacturer1 Datasheet: \\cern.ch\dfs\Applications\Altium\Datasheets\R0603_NIC_NRC.pdf; Value: 2k2; Power: 0.1W; TC: ±100ppm/°C; Table: Resistors SMD; Part Number: R0603_2K2_1%_0.1W_100PPM; Component Kind: Standard; Component Type: Standard; Designator: Resistor - 1%; Library Reference: Resistor - 1%; Pin Count: 2; Status: Preferred; Tolerance: ±1%; Manufacturer Part Number: R0603_2K2_1%_0.1W_100PPM; Case: 0603; Mounted: Yes; Socket: No; SMD: Yes; Manufacturer1 Example: NIC COMPONENT; Manufacturer1 ComponentHeight: 0.55mm; HelpURL: \\cern.ch\dfs\Applications\Altium\Datasheets\R0603_NIC_NRC.pdf; Author: CERN DEM JLC; CreateDate: 12/3/2007; LatestRevisionDate: 3/13/2008
R26 = R0603_33R_1%_0.1W_100PPM: as R55 on sheet CLKB_main; Part Number: R0603_33R_1%_0.1W_100PPM; Component Kind: Standard; Component Type: Standard; Designator: Resistor - 1%; Library Reference: Resistor - 1%; Pin Count: 2; Value: 33; Status: Preferred; Tolerance: ±1%; Manufacturer Part Number: R0603_33R_1%_0.1W_100PPM; Case: 0603; Mounted: Yes; Socket: No; SMD: Yes; Manufacturer1 Example: NIC COMPONENT; Manufacturer1 ComponentHeight: 0.55mm; HelpURL: \\cern.ch\dfs\Applications\Altium\Datasheets\R0603_NIC_NRC.pdf; Author: CERN DEM JLC; CreateDate: 12/3/2007; LatestRevisionDate: 3/13/2008
R28 R29 R37 R38 = R0603_10K_1%_0.1W_100PPM: Resistor - 1%; Part Description: General Purpose Thick Film Chip Resistor; Manufacturer: GENERIC; Manufacturer1 Part Number: NRC06F1002TRF; Manufacturer1 Datasheet: \\cern.ch\dfs\Applications\Altium\Datasheets\R0603_NIC_NRC.pdf; Power: 0.1W; TC: ±100ppm/°C; Table: Resistors SMD; Part Number: R0603_10K_1%_0.1W_100PPM; Component Kind: Standard; Component Type: Standard; Designator: Resistor - 1%; Library Reference: Resistor - 1%; Pin Count: 2; Value: 10k; Status: Preferred; Tolerance: ±1%; Manufacturer Part Number: R0603_10K_1%_0.1W_100PPM; Case: 0603; Mounted: Yes; Socket: No; SMD: Yes; Manufacturer1 Example: NIC COMPONENT; Manufacturer1 ComponentHeight: 0.55mm; HelpURL: \\cern.ch\dfs\Applications\Altium\Datasheets\R0603_NIC_NRC.pdf; Author: CERN DEM JLC; CreateDate: 12/3/2007; LatestRevisionDate: 3/13/2008
R30 R31 R40 R45 R52 = R0603_470R_1%_0.1W_100PPM: Resistor - 1%; Part Description: General Purpose Thick Film Chip Resistor; Manufacturer: GENERIC; Manufacturer1 Part Number: NRC06F4700TRF; Manufacturer1 Datasheet: \\cern.ch\dfs\Applications\Altium\Datasheets\R0603_NIC_NRC.pdf; Power: 0.1W; TC: ±100ppm/°C; Table: Resistors SMD; Part Number: R0603_470R_1%_0.1W_100PPM; Component Kind: Standard; Component Type: Standard; Designator: Resistor - 1%; Library Reference: Resistor - 1%; Pin Count: 2; Value: 470; Status: Preferred; Tolerance: ±1%; Manufacturer Part Number: R0603_470R_1%_0.1W_100PPM; Case: 0603; Mounted: Yes; Socket: No; SMD: Yes; Manufacturer1 Example: NIC COMPONENT; Manufacturer1 ComponentHeight: 0.55mm; HelpURL: \\cern.ch\dfs\Applications\Altium\Datasheets\R0603_NIC_NRC.pdf; Author: CERN DEM JLC; CreateDate: 12/3/2007; LatestRevisionDate: 3/13/2008
R32 R35 R36 R43 R44 R46 R48-R51 = R0603_49R9_0.1%_0.063W_10PPM: Resistor - 0.1%; Part Description: Thin Film Chip Resistor; Manufacturer: GENERIC; Manufacturer1 Part Number: RN73C1J49R9BTDF; Manufacturer1 Datasheet: \\cern.ch\dfs\Applications\Altium\Datasheets\R0603_Tyco_RN73.pdf; Value: 49R9; Power: 0.063W; TC: ±10ppm; Table: Resistors SMD; Part Number: R0603_49R9_0.1%_0.063W_10PPM; Component Kind: Standard; Component Type: Standard; Designator: Resistor - 0.1%; Library Reference: Resistor - 0.1%; Pin Count: 2; Status: Not recommended; Tolerance: ±0.1%; Manufacturer Part Number: R0603_49R9_0.1%_0.063W_10PPM; Case: 0603; Mounted: Yes; Socket: No; SMD: Yes; Manufacturer1 Example: TYCO HOLSWORTHY; Manufacturer1 ComponentHeight: 0.5mm; HelpURL: \\cern.ch\dfs\Applications\Altium\Datasheets\R0603_Tyco_RN73.pdf; Author: CERN DEM JLC; CreateDate: 12/3/2007; LatestRevisionDate: 3/13/2008
R33 R34 R41 R42 R47 = R0603_100R_1%_0.1W_100PPM: Resistor - 1%; Part Description: General Purpose Thick Film Chip Resistor; Manufacturer: GENERIC; Manufacturer1 Part Number: NRC06F4700TRF; Manufacturer1 Datasheet: \\cern.ch\dfs\Applications\Altium\Datasheets\R0603_NIC_NRC.pdf; Power: 0.1W; TC: ±100ppm/°C; Table: Resistors SMD; Part Number: R0603_100R_1%_0.1W_100PPM; Component Kind: Standard; Component Type: Standard; Designator: Resistor - 1%; Library Reference: Resistor - 1%; Pin Count: 2; Value: 100; Status: Preferred; Tolerance: ±1%; Manufacturer Part Number: R0603_100R_1%_0.1W_100PPM; Case: 0603; Mounted: Yes; Socket: No; SMD: Yes; Manufacturer1 Example: NIC COMPONENT; Manufacturer1 ComponentHeight: 0.55mm; HelpURL: \\cern.ch\dfs\Applications\Altium\Datasheets\R0603_NIC_NRC.pdf; Author: CERN DEM JLC; CreateDate: 12/3/2007; LatestRevisionDate: 3/13/2008
R39 = R0603_100K_1%_0.1W_100PPM: Resistor - 1%; Part Description: General Purpose Thick Film Chip Resistor; Manufacturer: GENERIC; Manufacturer1 Part Number: NRC06F1003TRF; Manufacturer1 Datasheet: \\cern.ch\dfs\Applications\Altium\Datasheets\R0603_NIC_NRC.pdf; Power: 0.1W; TC: ±100ppm/°C; Table: Resistors SMD; Part Number: R0603_100K_1%_0.1W_100PPM; Component Kind: Standard; Component Type: Standard; Designator: Resistor - 1%; Library Reference: Resistor - 1%; Pin Count: 2; Value: 100k; Status: Preferred; Tolerance: ±1%; Manufacturer Part Number: R0603_100K_1%_0.1W_100PPM; Case: 0603; Mounted: Yes; Socket: No; SMD: Yes; Manufacturer1 Example: NIC COMPONENT; Manufacturer1 ComponentHeight: 0.55mm; HelpURL: \\cern.ch\dfs\Applications\Altium\Datasheets\R0603_NIC_NRC.pdf; Author: CERN DEM JLC; CreateDate: 12/3/2007; LatestRevisionDate: 3/13/2008

## Sheet CLKB_power_regulators.SchDoc
size A4
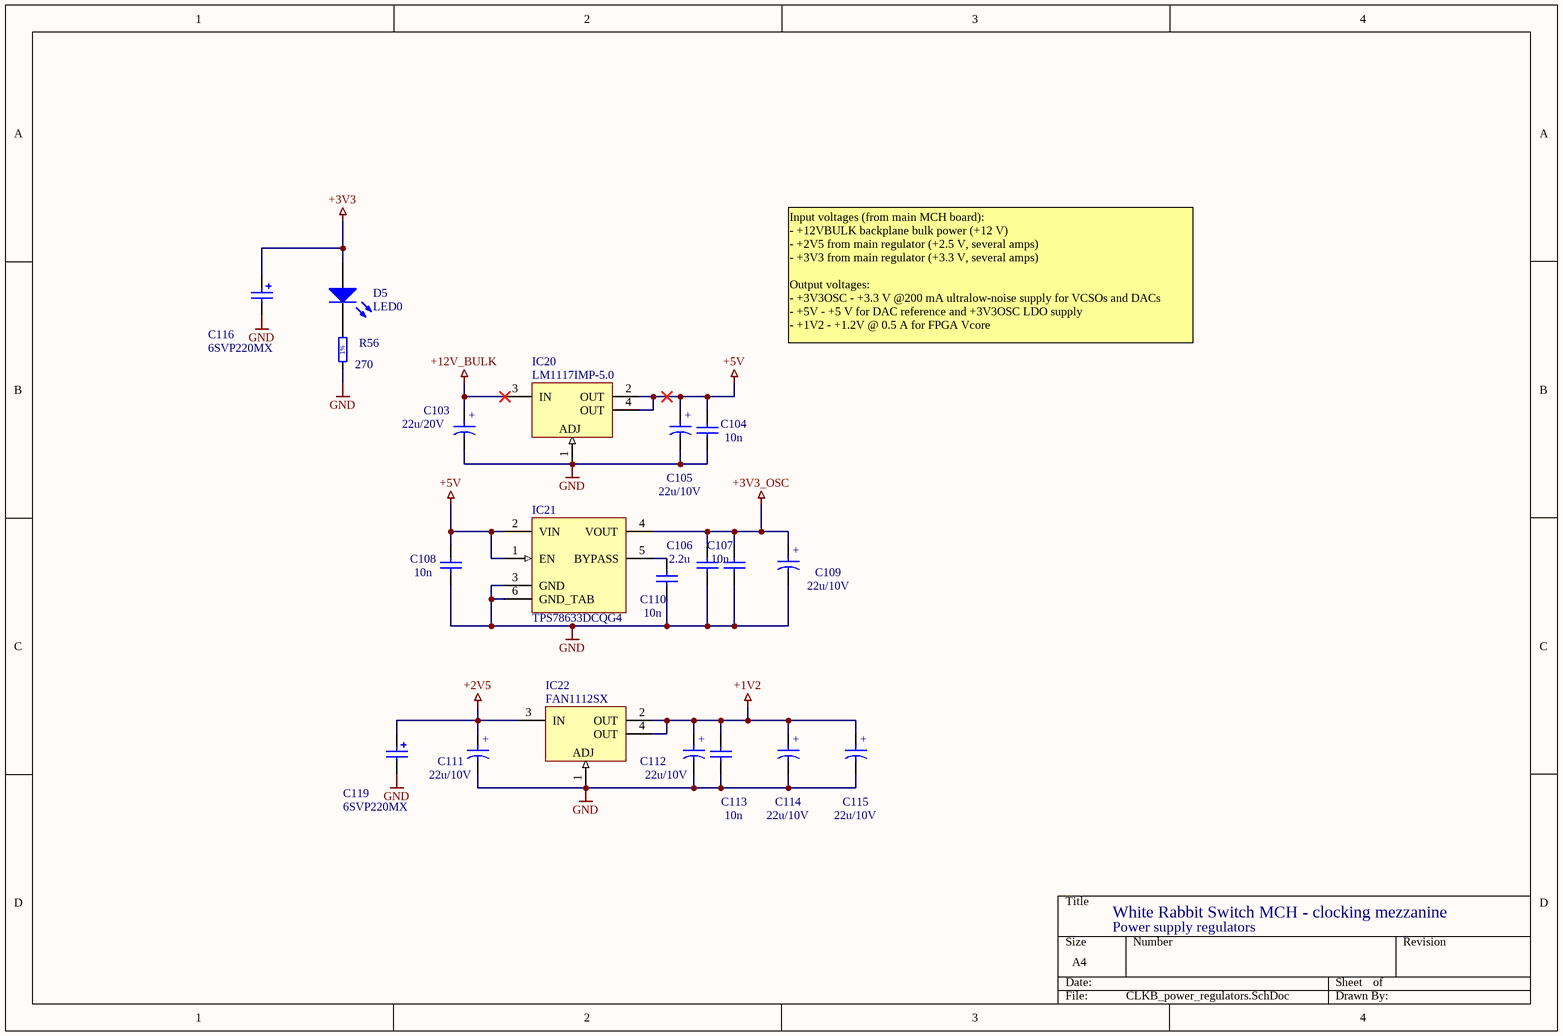
[diagram p3: CLKB_power_regulators.SchDoc]

### Parts
C103  22u/20V  [CAPMP3528X210N]
C104  22u/10V  [CAPMP3216X180N]
C105  10n  [CAPC1608X87N]
C106  2.2u  [CAPC2012X135N]
C107  10n  [CAPC1608X87N]
C108  10n  [CAPC1608X87N]
C109  22u/10V  [CAPMP3216X180N]
C110  10n  [CAPC1608X87N]
C111  22u/10V  [CAPMP3216X180N]
C112  10n  [CAPC1608X87N]
C113  22u/10V  [CAPMP3216X180N]
C114  22u/10V  [CAPMP3216X180N]
C115  22u/10V  [CAPMP3216X180N]
C116  value 6SVP220MX  [OSCON_E7]  (hidden comment: Cap Pol1)
C119  value 6SVP220MX  [OSCON_E7]  (hidden comment: Cap Pol1)
D5  LED0  [CD1608-0603]
IC20  value LM1117IMP-5.0  [SOT223-4L]  (hidden comment: LM1117)
IC21  value TPS78633DCQG4  [SOT223-6L]  (hidden comment: TPS786xx)
IC22  value FAN1112SX  [SOT223-4L]  (hidden comment: LM1117)
R56  270  [RESC1608X55N]

### Nets
+1V2: C112.2 C113.1 C114.1 C115.1 IC22.2(OUT) IC22.4(OUT)
+2V5: C111.1 C119.1 IC22.3(IN)
+3V3: C116.1 D5.1(A)
+3V3_OSC: C106.2 C107.2 C109.1 IC21.4(VOUT)
+5V: C104.1 C105.2 C108.2 IC20.2(OUT) IC20.4(OUT) IC21.1(EN) IC21.2(VIN)
+12V_BULK: C103.1 IC20.3(IN)
GND: C103.2 C104.2 C105.1 C106.1 C107.1 C108.1 C109.2 C110.1 C111.2 C112.1 C113.2 C114.2 C115.2 C116.2 C119.2 IC20.1(ADJ) IC21.3(GND) IC21.6(GND_TAB) IC22.1(ADJ) R56.1
NetC110_2: C110.2 IC21.5(BYPASS)
NetD5_2: D5.2(K) R56.2

### Notes on the sheet
- Input voltages (from main MCH board):
  - +12VBULK backplane bulk power (+12 V)
  - +2V5 from main regulator (+2.5 V, several amps)
  - +3V3 from main regulator (+3.3 V, several amps)
  Output voltages:
  - +3V3OSC - +3.3 V @200 mA ultralow-noise supply for VCSOs and DACs
  - +5V - +5 V for DAC reference and +3V3OSC LDO supply
  - +1V2 - +1.2V @ 0.5 A for FPGA Vcore
- White Rabbit Switch MCH - clocking mezzanine
- Power supply regulators
- (in symbol CTE3216-18_22UF_10V_10%) +
- (in symbol CTE3528-21_22UF_20V_10%) +
- (in symbol R0603_270R_1%_0.1W_100PPM) 1%

### Library data of the parts
C103 = CTE3528-21_22UF_20V_10%: Polarised capacitor; Part Description: Solid Tantalum Chip Capacitor; Manufacturer: GENERIC; Manufacturer1 Part Number: TAJB226K020R; Manufacturer1 Datasheet: \\cern.ch\dfs\Applications\Altium\Datasheets\CTE_AVX_TAJ.pdf; Value: 22uF; Voltage: 20V; Tolerance: ±10%; Table: Capacitors SMD; Part Number: CTE3528-21_22UF_20V_10%; Component Kind: Standard; Component Type: Standard; Designator: Capacitor - polarized; Library Reference: Capacitor - polarized; Pin Count: 2; Status: Preferred; Manufacturer Part Number: CTE3528-21_22UF_20V_10%; Case: B; Mounted: Yes; Socket: No; SMD: Yes; Manufacturer1 Example: AVX; Manufacturer1 ComponentHeight: 2.1mm; HelpURL: \\cern.ch\dfs\Applications\Altium\Datasheets\CTE_AVX_TAJ.pdf; Author: CERN DEM JLC; CreateDate: 12/3/2007; LatestRevisionDate: 12/3/2007
C104 C109 C111 C113-C115 = CTE3216-18_22UF_10V_10%: Polarised capacitor; Part Description: Solid Tantalum Chip Capacitor; Manufacturer: GENERIC; Manufacturer1 Part Number: TAJA226K010R; Manufacturer1 Datasheet: \\cern.ch\dfs\Applications\Altium\Datasheets\CTE_AVX_TAJ.pdf; Value: 22uF; Voltage: 10V; Tolerance: ±10%; Table: Capacitors SMD; Part Number: CTE3216-18_22UF_10V_10%; Component Kind: Standard; Component Type: Standard; Designator: Capacitor - polarized; Library Reference: Capacitor - polarized; Pin Count: 2; Status: Preferred; Manufacturer Part Number: CTE3216-18_22UF_10V_10%; Case: A; Mounted: Yes; Socket: No; SMD: Yes; Manufacturer1 Example: AVX; Manufacturer1 ComponentHeight: 1.8mm; HelpURL: \\cern.ch\dfs\Applications\Altium\Datasheets\CTE_AVX_TAJ.pdf; Author: CERN DEM JLC; CreateDate: 12/3/2007; LatestRevisionDate: 12/3/2007
C105 C107 C108 C110 C112 = CC0603_10NF_50V_10%_X7R: as C41 on sheet CLKB_clocking_system; Part Number: CC0603_10NF_50V_10%_X7R; Component Kind: Standard; Component Type: Standard; Designator: Capacitor - non polarized; Library Reference: Capacitor - non polarized; Pin Count: 2; Status: Preferred; Manufacturer Part Number: CC0603_10NF_50V_10%_X7R; Case: 0603; Mounted: Yes; Socket: No; SMD: Yes; Manufacturer1 Example: PHYCOMP; Manufacturer1 ComponentHeight: 0.87mm; HelpURL: \\cern.ch\dfs\Applications\Altium\Datasheets\CC0603_X7R_PHYCOMP.pdf; Author: CERN DEM JLC; CreateDate: 12/3/2007; LatestRevisionDate: 12/3/2007
C106 = CC0805_2.2UF_16V_10%_X7R: Non-polarised capacitor; Part Description: SMD Multilayer Chip Ceramic Capacitor; Manufacturer: GENERIC; Manufacturer1 Part Number: GRM21BF51C225ZA01L; Manufacturer1 Datasheet: \\cern.ch\dfs\Applications\Altium\Datasheets\CC0805_X7R_KEMET.pdf; Value: 2.2uF; Voltage: 16V; TC: X7R; Tolerance: ±10%; Table: Capacitors SMD; Part Number: CC0805_2.2UF_16V_10%_X7R; Component Kind: Standard; Component Type: Standard; Designator: Capacitor - non polarized; Library Reference: Capacitor - non polarized; Pin Count: 2; Status: Preferred; Manufacturer Part Number: CC0805_2.2UF_16V_10%_X7R; Case: 0805; Mounted: Yes; Socket: No; SMD: Yes; Manufacturer1 Example: MURATA; Manufacturer1 ComponentHeight: 1.5mm; HelpURL: \\cern.ch\dfs\Applications\Altium\Datasheets\CC0805_X7R_KEMET.pdf; Author: CERN DEM JLC; CreateDate: 12/3/2007; LatestRevisionDate: 12/3/2007
C116 C119 = Cap Pol1: Polarized Capacitor (Radial); RefId: 9188819; Published: 8-Jun-2000; LatestRevisionDate: 17-Jul-2002; LatestRevisionNote: Re-released for DXP Platform.; PackageReference: RB7.6-15; Publisher: Altium Limited; Supplier: Farnell; ClassName: PSU_2V5
D5 = LED0: Red chip LED; Published: 8-Jun-2000; LatestRevisionDate: 08-Jul-2005; LatestRevisionNote: Mech Layer 1 removed.; PackageReference: LED-0; Publisher: Altium Limited
IC20 = 1117: Three-Terminal Adjustable Output Positive Voltage Regulator; Package Information: Latest Revision: 1997; Note: Heatsink surface connected to Pin 2; Code - JEDEC: TO-262-AA; RefId: 1469052; Published: 15-Apr-2002; Datasheet: Latest Revision: 1996; Package Reference: 221A-06; Publisher: Altium Limited; Supplier: Farnell
IC21 = TPS786xx: TI low noise LDO, 1A load; RefId: 1207352; Supplier: Farnell
IC22 = 1117: Three-Terminal Adjustable Output Positive Voltage Regulator; Package Information: Latest Revision: 1997; Note: Heatsink surface connected to Pin 2; Code - JEDEC: TO-262-AA; RefId: 1467363; Published: 15-Apr-2002; Datasheet: Latest Revision: 1996; Package Reference: 221A-06; Publisher: Altium Limited; Supplier: Farnell
R56 = R0603_270R_1%_0.1W_100PPM: Resistor - 1%; Part Description: General Purpose Thick Film Chip Resistor; Manufacturer: GENERIC; Manufacturer1 Part Number: NRC06F2700TRF; Manufacturer1 Datasheet: \\cern.ch\dfs\Applications\Altium\Datasheets\R0603_NIC_NRC.pdf; Power: 0.1W; TC: ±100ppm/°C; Table: Resistors SMD; Part Number: R0603_270R_1%_0.1W_100PPM; Component Kind: Standard; Component Type: Standard; Designator: Resistor - 1%; Library Reference: Resistor - 1%; Pin Count: 2; Value: 270; Status: Preferred; Tolerance: ±1%; Manufacturer Part Number: R0603_270R_1%_0.1W_100PPM; Case: 0603; Mounted: Yes; Socket: No; SMD: Yes; Manufacturer1 Example: NIC COMPONENT; Manufacturer1 ComponentHeight: 0.55mm; HelpURL: \\cern.ch\dfs\Applications\Altium\Datasheets\R0603_NIC_NRC.pdf; Author: CERN DEM JLC; CreateDate: 12/3/2007; LatestRevisionDate: 3/13/2008